# EAGLE schematic DWM1000_Feather (EAGLE 9.5.0)
CNAME: UWB Feather; CREVISION: 1.1; DESIGNER: Jedidiah Hodson
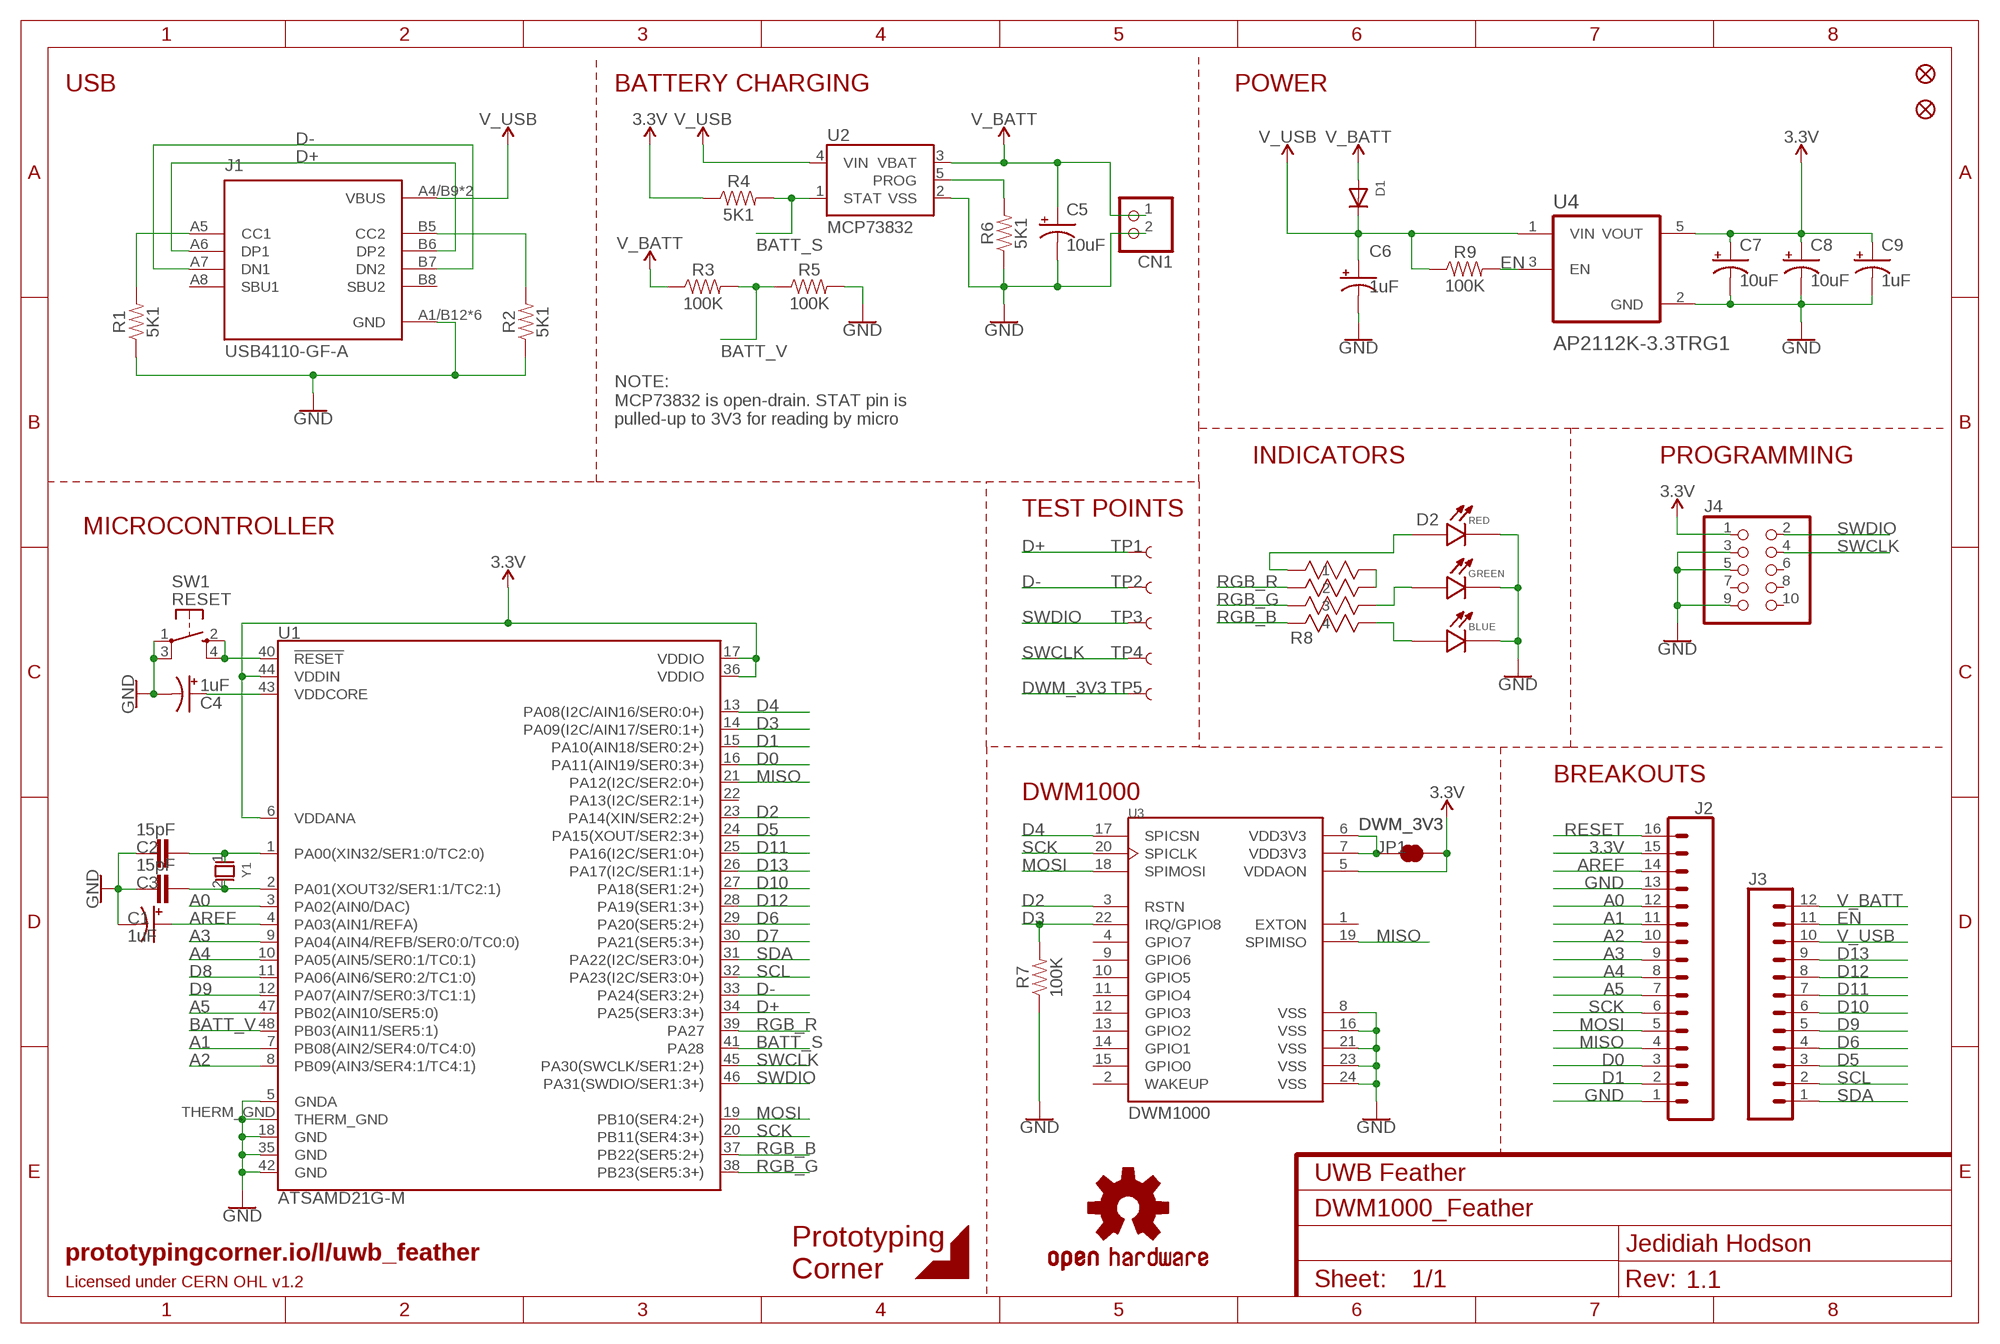
[diagram p0: schematic, sheet 1]

## Parts
C1  1uF  10UF-POLAR-0603-6.3V-20%(TANT)  [0603-POLAR]
C2  15pF  15PF-0402-50V-5%  [0402]
C3  15pF  15PF-0402-50V-5%  [0402]
C4  1uF  10UF-POLAR-0603-6.3V-20%(TANT)  [0603-POLAR]
C5  10uF  10UF-POLAR-0603-6.3V-20%(TANT)  [0603-POLAR]
C6  1uF  10UF-POLAR-0603-6.3V-20%(TANT)  [0603-POLAR]
C7  10uF  10UF-POLAR-0603-6.3V-20%(TANT)  [0603-POLAR]
C8  10uF  10UF-POLAR-0603-6.3V-20%(TANT)  [0603-POLAR]
C9  1uF  10UF-POLAR-0603-6.3V-20%(TANT)  [0603-POLAR]
CN1  JST_2PIN-SMT-RA  [JST-PH-2-SMT-RA]
D1  DIODE_SOD-123FL  [SOD-123FL]
D2  ASMT-YTD7-0AA02  [LED_ASMT-YTD7-0AA02]
FD1  FIDUCIALUFIDUCIAL  [FIDUCIAL-MICRO]
FD2  FIDUCIALUFIDUCIAL  [FIDUCIAL-MICRO]
J1  USB4110-GF-A  [GCT_USB4110-GF-A]
J2  CONN_161X16_NO_SILK  [1X16_NO_SILK]
J3  CONN_12NO_SILK  [1X12_NO_SILK]
J4  20021221-00010C4LF  [20021221-00010C4LF]
JP1  DWM_3V3  JUMPER-SMT_2_NC_TRACE_SILK  [SMT-JUMPER_2_NC_TRACE_SILK]
LOGO1  OSHW-LOGOS  [OSHW-LOGO-S]
R1  5K1  RESISTOR0603  [0603]
R2  5K1  RESISTOR0603  [0603]
R3  100K  RESISTOR0603  [0603]
R4  5K1  RESISTOR0603  [0603]
R5  100K  RESISTOR0603  [0603]
R6  5K1  RESISTOR0603  [0603]
R7  100K  RESISTOR0603  [0603]
R8  YC124-JR-07330RL  [YAG_YC124]
R9  100K  RESISTOR0603  [0603]
SW1  SPST_TACT-KMR2  [KMR2]
TP1  TEST-POINT3  [PAD.03X.03]
TP2  TEST-POINT3  [PAD.03X.03]
TP3  TEST-POINT3  [PAD.03X.03]
TP4  TEST-POINT3  [PAD.03X.03]
TP5  TEST-POINT3  [PAD.03X.03]
U1  ATSAMD21G-M  [QFN-48]
U2  MCP73832  MCP73831  [SOT23-5]
U3  DWM1000  [XCVR_DWM1000]
U4  AP2112K-3.3TRG1  [SOT95P285X140-5N]
Y1  FC-135_32.7680KA-A0  [XTAL_FC-135_32.7680KA-A0]

## Nets
3.3V: C7.+ C8.+ C9.+ J2.15 J4.1 JP1.2 R4.1 U1.6(VDDANA) U1.17(VDDIO) U1.36(VDDIO) U1.44(VDDIN) U3.5(VDDAON) U4.5(VOUT)
A0: J2.12 U1.3(PA02(AIN0/DAC))
A1: J2.11 U1.7(PB08(AIN2/SER4:0/TC4:0))
A2: J2.10 U1.8(PB09(AIN3/SER4:1/TC4:1))
A3: J2.9 U1.9(PA04(AIN4/REFB/SER0:0/TC0:0))
A4: J2.8 U1.10(PA05(AIN5/SER0:1/TC0:1))
A5: J2.7 U1.47(PB02(AIN10/SER5:0))
AREF: C1.+ J2.14 U1.4(PA03(AIN1/REFA))
BATT_S: R4.2 U1.41(PA28) U2.1(STAT)
BATT_V: R3.2 R5.1 U1.48(PB03(AIN11/SER5:1))
D0: J2.3 U1.16(PA11(AIN19/SER0:3+))
D1: J2.2 U1.15(PA10(AIN18/SER0:2+))
D2: U1.23(PA14(XIN/SER2:2+)) U3.3(RSTN)
D3: R7.2 U1.14(PA09(I2C/AIN17/SER0:1+)) U3.22(IRQ/GPIO8)
D4: U1.13(PA08(I2C/AIN16/SER0:0+)) U3.17(SPICSN)
D5: J3.3 U1.24(PA15(XOUT/SER2:3+))
D6: J3.4 U1.29(PA20(SER5:2+))
D7: U1.30(PA21(SER5:3+))
D8: U1.11(PA06(AIN6/SER0:2/TC1:0))
D9: J3.5 U1.12(PA07(AIN7/SER0:3/TC1:1))
D10: J3.6 U1.27(PA18(SER1:2+))
D11: J3.7 U1.25(PA16(I2C/SER1:0+))
D12: J3.8 U1.28(PA19(SER1:3+))
D13: J3.9 U1.26(PA17(I2C/SER1:1+))
D+: J1.A6(DP1) J1.B6(DP2) TP1.P$1 U1.34(PA25(SER3:3+))
D-: J1.A7(DN1) J1.B7(DN2) TP2.P$1 U1.33(PA24(SER3:2+))
DWM_3V3: JP1.1 TP5.P$1 U3.6(VDD3V3) U3.7(VDD3V3)
EN: J3.11 R9.2 U4.3(EN)
GND: C1.- C2.1 C3.1 C4.- C5.- C6.- C7.- C8.- C9.- CN1.2 D2.1(B_C) D2.2(G_C) D2.3(R_C) J1.A1/B12(GND) J1.B1/A12(GND) J1.S1(GND) J1.S2(GND) J1.S3(GND) J1.S4(GND) J2.1 J2.13 J4.3 J4.5 J4.9 R1.1 R2.1 R5.2 R6.1 R7.1 SW1.1(P) SW1.3(P1) U1.5(GNDA) U1.18(GND) U1.35(GND) U1.42(GND) U1.THERM_GND U2.2(VSS) U3.8(VSS) U3.16(VSS) U3.21(VSS) U3.23(VSS) U3.24(VSS) U4.2(GND)
MISO: J2.4 U1.21(PA12(I2C/SER2:0+)) U3.19(SPIMISO)
MOSI: J2.5 U1.19(PB10(SER4:2+)) U3.18(SPIMOSI)
N$1: D2.6(B_A) R8.5
N$3: D2.5(G_A) R8.6
N$4: R8.7 R8.8
N$5: D2.4(R_A) R8.1
N$6: R6.2 U2.5(PROG)
N$8: J1.A5(CC1) R1.2
N$10: J1.B5(CC2) R2.2
N$15: C2.2 U1.1(PA00(XIN32/SER1:0/TC2:0)) Y1.1
N$16: C4.+ U1.43(VDDCORE)
N$17: C3.2 U1.2(PA01(XOUT32/SER1:1/TC2:1)) Y1.2
RESET: J2.16 SW1.2(S) SW1.4(S1) U1.40(!RESET!)
RGB_B: R8.4 U1.37(PB22(SER5:2+))
RGB_G: R8.3 U1.38(PB23(SER5:3+))
RGB_R: R8.2 U1.39(PA27)
SCK: J2.6 U1.20(PB11(SER4:3+)) U3.20(SPICLK)
SCL: J3.2 U1.32(PA23(I2C/SER3:0+))
SDA: J3.1 U1.31(PA22(I2C/SER3:0+))
SWCLK: J4.4 TP4.P$1 U1.45(PA30(SWCLK/SER1:2+))
SWDIO: J4.2 TP3.P$1 U1.46(PA31(SWDIO/SER1:3+))
V_BATT: C5.+ CN1.1 D1.A J3.12 R3.1 U2.3(VBAT)
V_USB: C6.+ D1.C J1.A4/B9(VBUS) J1.B4/A9(VBUS) J3.10 R9.1 U2.4(VIN) U4.1(VIN)
Unconnected: J1.A8(SBU1) J1.B8(SBU2) J4.6 J4.7 J4.8 J4.10 U1.22(PA13(I2C/SER2:1+)) U3.1(EXTON) U3.2(WAKEUP) U3.4(GPIO7) U3.9(GPIO6) U3.10(GPIO5) U3.11(GPIO4) U3.12(GPIO3) U3.13(GPIO2) U3.14(GPIO1) U3.15(GPIO0)

## Notes on the sheet
- USB | BATTERY CHARGING | POWER
- NOTE:
  MCP73832 is open-drain. STAT pin is 
  pulled-up to 3V3 for reading by micro
- INDICATORS | PROGRAMMING
- TEST POINTS
- MICROCONTROLLER
- BREAKOUTS
- DWM1000
- prototypingcorner.io/l/uwb_feather
- Prototyping
  Corner
- Licensed under CERN OHL v1.2

## Library data of the parts
C1 C4 C6 C9 = SparkFun-Capacitors-edit:10UF-POLAR: 10.0µF polarized capacitors A capacitor is a passive two-terminal electrical component used to store electrical energy temporarily in an electric field.; PROD_ID: CAP-13210; VALUE: 10uF
C2 C3 = SparkFun-Capacitors:15PF: 15pF ceramic capacitors A capacitor is a passive two-terminal electrical component used to store electrical energy temporarily in an electric field.; PROD_ID: CAP-13063
C5 C7 C8 = SparkFun-Capacitors-edit:10UF-POLAR: 10.0µF polarized capacitors A capacitor is a passive two-terminal electrical component used to store electrical energy temporarily in an electric field.; PROD_ID: CAP-13210
CN1 = adafruit:JST_2PIN: JST 2-Pin Connectors of various flavors SMT-RA (S2B-PH-SM4) 4UConnector #17311 SMT (B2B-PH-SM4) THM-RA (S2B-PH) THM (B2B-PH)
D1 = adafruit:DIODE: Diode SMADIODE - SMA Surface Mount Package 20V 1A Schottky Diode Digikey: 641-1014-6-ND DO-1N4148 - Through Hole Small Current Diode SOD-123 20V 1 A (.5mV Vf) Schottky Diode - Digikey: MBRX120TPMSCT-ND SOD-323 10V 570mA (.38mV Vf, 3ns) Schottky Diode - Digikey: ZLLS410CT-ND SOD-523 30V 30mA Schottky Diode (RB751S-40TE61) - Digikey: RB751S-40TE61CT-ND SOT23-R/W - SOT23 Package (R = Solder Paste/Reflow Ovens, W = Hand-Soldering) BAT54Film 40V 300mA - Digikey: 497-7162-1-ND
D2 = ASMT-YTD7-0AA02:ASMT-YTD7-0AA02: SMD LED RGB 1.8...3.6 V PLCC-6 | Broadcom ASMTYTD70AA02 @ LED, SMD (SMD LED RGB 1.8...3.6 V PLCC-6 LEDs – SMD).; AVAILABILITY: Unavailable; DESCRIPTION: Red, Green, Blue _RGB_ 623nm Red, 529nm Green, 469nm Blue LED Indication - Discrete 2.1V Red, 3.1V Green, 3.1V Blue 6-SMD, J-Lead; MF: Broadcom Limited; MP: ASMT-YTD7-0AA02; PACKAGE: PLCC-6 Broadcom; PRICE: None
FD1 FD2 = SparkFun-Aesthetics:FIDUCIAL: Fiducial Alignment Points Point-of-reference for pick-and-place machines and other optical instruments.
J1 = USB4110-GF-A:USB4110-GF-A: CONN USB 2.0 TYPE-C R/A SMT; AVAILABILITY: Unavailable; DESCRIPTION: USB - C _Type - C_ USB 2.0 Receptacle Connector 24 _16+8 Dummy_ Position Surface Mount, Right Angle; Through Hole; MF: GCT; MP: USB4110-GF-A; PACKAGE: None; PRICE: None
J2 = SparkFun-Connectors:CONN_16: Multi connection point. Often used as Generic Header-pin footprint for 0.1 inch spaced/style header connections On any of the 0.1 inch spaced packages, you can populate with these: Break Away Headers - Straight <https://www.sparkfun.com/products/116> (PRT-00116) Break Away Male Headers - Right Angle <https://www.sparkfun.com/products/553> (PRT-00553) Female Headers <https://www.sparkfun.com/products/115> (PRT-00115) Break Away Headers - Machine Pin <https://www.sparkfun.com/products/117> (PRT-00117) Break Away Female Headers - Swiss Machine Pin <https://www.sparkfun.com/products/743> (PRT-00743) For SCREWTERMINALS and SPRING TERMINALS visit here: Screw Terimnals on SparkFun.com <https://www.sparkfun.com/search/results?term=Screw+Terminals> (5mm/3.5mm/2.54mm spacing) This device is also useful as a general connection point to wire up your design to another part of your project. Our various solder wires solder well into these plated through hole pads. Hook-Up Wire - Assortment (Stranded, 22 AWG) <https://www.sparkfun.com/products/11375> (PRT-11375) Hook-Up Wire - Assortment (Solid Core, 22 AWG) <https://www.sparkfun.com/products/11367> (PRT-11367) View the entire wire category on our website here <https://www.sparkfun.com/categories/141> Special notes: Molex polarized connector foot print use with SKU : PRT-08231 with associated crimp pins and housings. 1MM SMD Version SKU: PRT-10208 NOTES ON THE VARIANTS LOCK and LOCK_LONGPADS... This footprint was designed to help hold the alignment of a through-hole component (i.e. 6-pin header) while soldering it into place. You may notice that each hole has been shifted either up or down by 0.005 of an inch from it's more standard position (which is a perfectly straight line). This slight alteration caused the pins (the squares in the middle) to touch the edges of the holes. Because they are alternating, it causes a "brace" to hold the component in place. 0.005 has proven to be the perfect amount of "off-center" position when using our standard breakaway headers. Although looks a little odd when you look at the bare footprint, once you have a header in there, the alteration is very hard to notice. Also,if you push a header all the way into place, it is covered up entirely on the bottom side.
J3 = SparkFun-Connectors:CONN_12: Multi connection point. Often used as Generic Header-pin footprint for 0.1 inch spaced/style header connections On any of the 0.1 inch spaced packages, you can populate with these: Break Away Headers - Straight <https://www.sparkfun.com/products/116> (PRT-00116) Break Away Male Headers - Right Angle <https://www.sparkfun.com/products/553> (PRT-00553) Female Headers <https://www.sparkfun.com/products/115> (PRT-00115) Break Away Headers - Machine Pin <https://www.sparkfun.com/products/117> (PRT-00117) Break Away Female Headers - Swiss Machine Pin <https://www.sparkfun.com/products/743> (PRT-00743) For SCREWTERMINALS and SPRING TERMINALS visit here: Screw Terimnals on SparkFun.com <https://www.sparkfun.com/search/results?term=Screw+Terminals> (5mm/3.5mm/2.54mm spacing) This device is also useful as a general connection point to wire up your design to another part of your project. Our various solder wires solder well into these plated through hole pads. Hook-Up Wire - Assortment (Stranded, 22 AWG) <https://www.sparkfun.com/products/11375> (PRT-11375) Hook-Up Wire - Assortment (Solid Core, 22 AWG) <https://www.sparkfun.com/products/11367> (PRT-11367) View the entire wire category on our website here <https://www.sparkfun.com/categories/141> Special notes: Molex polarized connector foot print use with SKU : PRT-08231 with associated crimp pins and housings. 1MM SMD Version SKU: PRT-10208 NOTES ON THE VARIANTS LOCK and LOCK_LONGPADS... This footprint was designed to help hold the alignment of a through-hole component (i.e. 6-pin header) while soldering it into place. You may notice that each hole has been shifted either up or down by 0.005 of an inch from it's more standard position (which is a perfectly straight line). This slight alteration caused the pins (the squares in the middle) to touch the edges of the holes. Because they are alternating, it causes a "brace" to hold the component in place. 0.005 has proven to be the perfect amount of "off-center" position when using our standard breakaway headers. Although looks a little odd when you look at the bare footprint, once you have a header in there, the alteration is very hard to notice. Also,if you push a header all the way into place, it is covered up entirely on the bottom side.
J4 = 20021221-00010C4LF:20021221-00010C4LF: MINITEK 127 SHROUDED HDR Source: http://portal.fciconnect.com/Comergent//fci/drawing/20021221.pdf; DESCRIPTION: Conn Shrouded Header HDR 10 POS 1.27mm Solder ST SMD T/R; DIGI-KEY_PART_NUMBER: 609-3700-1-ND; DIGI-KEY_PURCHASE_URL: https://www.digikey.com.au/product-detail/en/amphenol-icc-fci/20021221-00010C4LF/609-3700-1-ND/2209154?utm_source=snapeda&utm_medium=aggregator&utm_campaign=symbol; MF: Amphenol ICC; MP: 20021221-00010C4LF; PACKAGE: None
JP1 = SparkFun-Jumpers:JUMPER-SMT_2_NC_TRACE: Normally closed trace jumper This jumper has a trace between two pads so it's normally closed (NC). Use a razor knife to open the connection. For best results follow the IPC guidelines for cutting traces: Cutout at least 0.063 mm (0.005 in). Remove all loose material to clean up the cut area. Seal the cut with an approved epoxy. Reapply solder to reclose the connection.
LOGO1 = SparkFun-Aesthetics:OSHW-LOGO: Open-Source Hardware (OSHW) Logo This logo indicates the piece of hardware it is found on incorporates a OSHW license and/or adheres to the definition of open source hardware found here: http://freedomdefined.org/OSHW
R1-R7 R9 = SparkFun-Resistors:RESISTOR: Generic Resistor Package
R8 = YC124-JR-07330RL:YC124-JR-07330RL; BUILT_BY: EMA_UL_Team; MANUFACTURER_PART_NUMBER: YC124-JR-07330RL; VENDOR: Yageo
SW1 = adafruit:SPST_TACT: SMT 6mm switch, EVQQ2 series http://www.ladyada.net/library/eagle
TP1-TP5 = SparkFun-Connectors:TEST-POINT: SparkFun Test Points Bare copper test points for troubleshooting or In-Circuit-Testing. These are used by our Production team for verifying production board runs using pogo-pins on test beds. SparkFun Products: SparkFun LSM9DS1 Breakout <https://www.sparkfun.com/products/13284> SparkFun PSOC <https://www.sparkfun.com/products/13714> SparkFun Load Cell Amplifier <https://www.sparkfun.com/products/13879>
U1 = SparkFun-IC-Microcontroller:ATSAMD21G: Atmel SAMD21G SMART ARM-Based Microcontroller The Atmel ® | SMART ™ SAM D21 is a series of low-power microcontrollers using the 32-bit ARM ® Cortex ® -M0+ processor, and ranging from 32- to 64-pins with up to 256KB Flash and 32KB of SRAM. The SAM D21 devices operate at a maximum frequency of 48MHz and reach 2.46 CoreMark/MHz. They are designed for simple and intuitive migration with identical peripheral modules, hex compatible code, identical linear address map and pin compatible migration paths between all devices in the product series. All devices include intelligent and flexible peripherals, Atmel Event System for inter-peripheral signaling, and support for capacitive touch button, slider and wheel user interfaces. Datasheet <https://cdn.sparkfun.com/datasheets/Dev/Arduino/Boards/Atmel-42181-SAM-D21_Datasheet.pdf> SparkFun Products SparkFun SAMD21 Mini Breakout <https://www.sparkfun.com/products/13664> (DEV-13664) SparkFun SAMD21 Dev Breakout <https://www.sparkfun.com/products/13672> (DEV-13672); PROD_ID: IC-13064
U2 = SparkFun-IC-Power:MCP73831: MCP73831T Li-Ion, Li-Pol Controller Miniature single cell, fully integrated Li-Ion, Li-polymer charge management controller Datasheet <http://ww1.microchip.com/downloads/en/DeviceDoc/20001984g.pdf> SparkFun Products: SparkFun ESP32 Thing <https://www.sparkfun.com/products/13907> SparkFun 9DoF Razor IMU M0 <https://www.sparkfun.com/products/14001>; PROD_ID: IC-09995
U3 = DWM1000:DWM1000: Mod Ieee802.15.4-2011 Uwb Txrx; AVAILABILITY: Unavailable; DESCRIPTION: Mod Ieee802.15.4-2011 Uwb Txrx; MF: Decawave Limited; MP: DWM1000; PACKAGE: Module Decawave; PRICE: None
U4 = AP2112K-3.3TRG1:AP2112K-3.3TRG1: AP2112 Series 0.6 A 3.3 V Fixed Output SMT LDO Linear Regulator - SOT23-5; DESCRIPTION: AP2112 Series 0.6 A 3.3 V Fixed Output SMT LDO Linear Regulator - SOT23-5; DIGI-KEY_PART_NUMBER: AP2112K-3.3TRG1DICT-ND; DIGI-KEY_PURCHASE_URL: https://www.digikey.com.au/product-detail/en/diodes-incorporated/AP2112K-3.3TRG1/AP2112K-3.3TRG1DICT-ND/4505257?utm_source=snapeda&utm_medium=aggregator&utm_campaign=symbol; MF: Diodes Inc.; MP: AP2112K-3.3TRG1; PACKAGE: SOT-753 Diodes Inc.
Y1 = FC-135_32.7680KA-A0:FC-135_32.7680KA-A0: None; DESCRIPTION: 32.7680 Khz 20ppm 12.5pf; DIGI-KEY_PART_NUMBER: SER4077CT-ND; DIGI-KEY_PURCHASE_URL: https://www.digikey.com.au/product-detail/en/epson/FC-135-32.7680KA-A0/SER4077CT-ND/5604233?utm_source=snapeda&utm_medium=aggregator&utm_campaign=symbol; MF: EPSON; MP: FC-135 32.7680KA-A0; PACKAGE: SMD-2 Epson